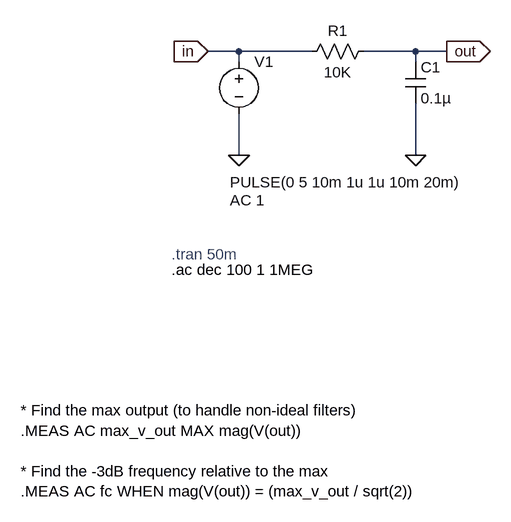
[diagram p0: schematic low_pass_filter_rc.asc]
low_pass_filter_rc.asc, the LTspice schematic file:
Version 4.1
SHEET 1 880 792
WIRE -32 112 -80 112
WIRE 80 112 -32 112
WIRE 240 112 160 112
WIRE 288 112 240 112
WIRE -32 128 -32 112
WIRE 240 128 240 112
WIRE -32 272 -32 208
WIRE 240 272 240 192
FLAG -32 272 0
FLAG 240 272 0
FLAG -80 112 in
IOPIN -80 112 In
FLAG 288 112 out
IOPIN 288 112 Out
SYMBOL res 176 96 R90
WINDOW 0 0 56 VBottom 2
WINDOW 3 32 56 VTop 2
SYMATTR InstName R1
SYMATTR Value 10K
SYMATTR SpiceLine tol=1 pwr=0.1
SYMBOL cap 224 128 R0
SYMATTR InstName C1
SYMATTR Value 0.1µ
SYMATTR SpiceLine V=4 Irms=0 Rser=0 Lser=0 mfg="Murata" pn="GRM022R60G153KE15" type="X5R"
SYMBOL voltage -32 112 R0
WINDOW 3 -14 201 Left 2
WINDOW 123 -14 229 Left 2
WINDOW 39 0 0 Left 0
SYMATTR InstName V1
SYMATTR Value PULSE(0 5 10m 1u 1u 10m 20m)
SYMATTR Value2 AC 1
TEXT -136 424 Left 2 ;.tran 50m
TEXT -136 448 Left 2 !.ac dec 100 1 1MEG
TEXT -368 664 Left 2 !* Find the max output (to handle non-ideal filters)\n.MEAS AC max_v_out MAX mag(V(out))\n \n* Find the -3dB frequency relative to the max\n.MEAS AC fc WHEN mag(V(out)) = (max_v_out / sqrt(2))

The netlist it stands for:
* low_pass_filter_rc.asc
R1 out in 10K tol=1 pwr=0.1
C1 out 0 0.1µ V=4 Irms=0 Rser=0 Lser=0 mfg="Murata" pn="GRM022R60G153KE15" type="X5R"
V1 in 0 PULSE(0 5 10m 1u 1u 10m 20m) AC 1
* .tran 50m
.ac dec 100 1 1MEG
* Find the max output (to handle non-ideal filters)
.MEAS AC max_v_out MAX mag(V(out))
* Find the -3dB frequency relative to the max
.MEAS AC fc WHEN mag(V(out)) = (max_v_out / sqrt(2))
.backanno
.end

* Results of the author's LTspice run, read from the files saved beside the schematic
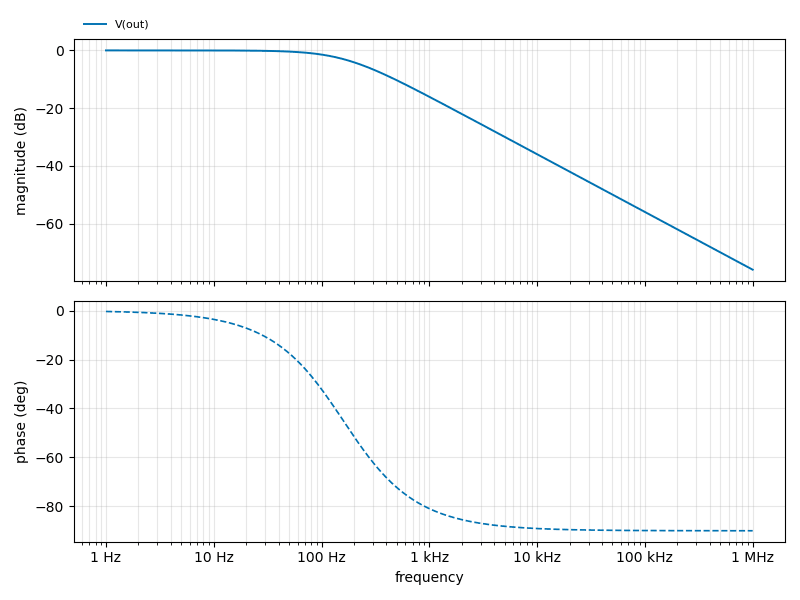
[diagram p1: AC Analysis of low_pass_filter_rc.asc, plotted from the saved traces]
* AC Analysis, 1 run:
*   V(out): -0.00 dB at 1 Hz, -75.96 dB at 1 MHz, peak -0.00 dB at 1 Hz, 3 dB below the peak at 159.2 Hz
* From the log:
*   max_v_out: MAX(mag(V(out)))=(-0.000171449204949dB,0°) FROM 1 TO 1000000
*   fc: mag(V(out)) =(max_v_out / sqrt(2)) AT 159.161319062